# EAGLE design CS-N-NPN (EAGLE 6.5.0)
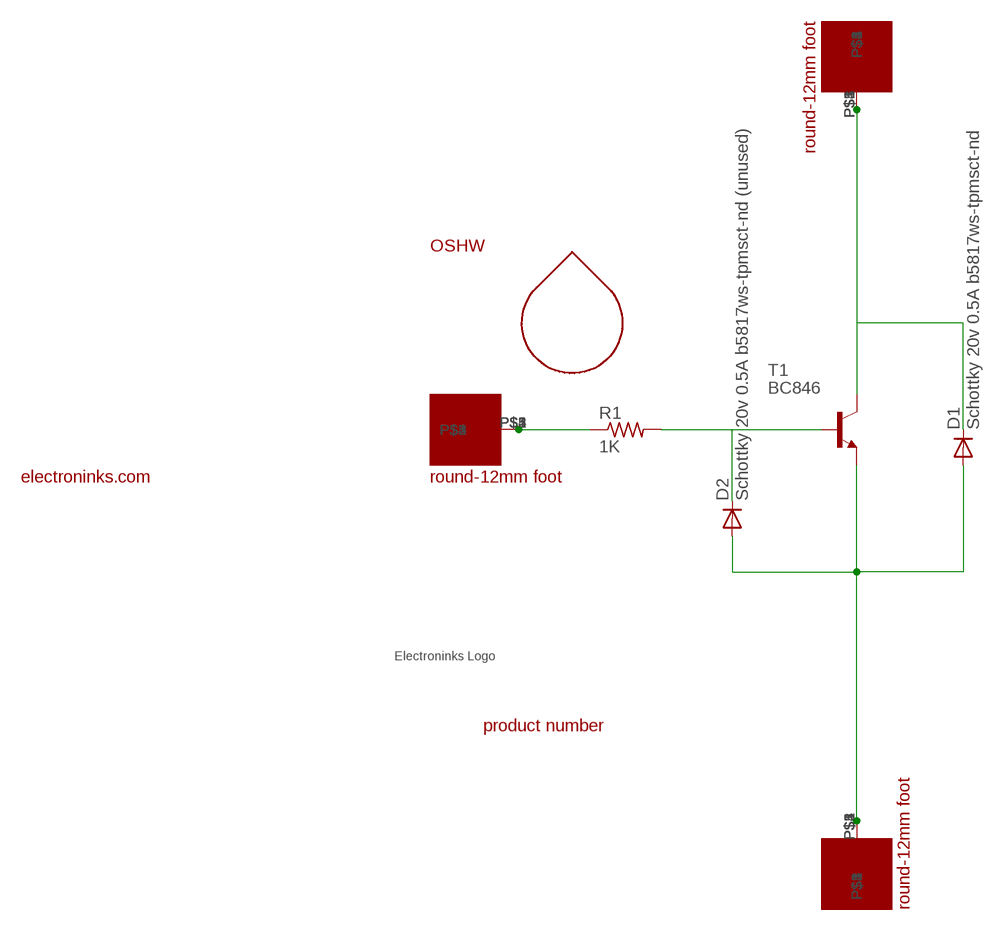
[diagram p0: schematic, sheet 1]

## Parts
D1  Schottky 20v 0.5A b5817ws-tpmsct-nd  DIODESOD  [SOD-323]
D2  Schottky 20v 0.5A b5817ws-tpmsct-nd (unused)  DIODESOD  [SOD-323]
R1  1K  R-US_R0603  [R0603]
T1  BC846  [SOT23]
U$1  ROUND-12MM-FOOT-1.8MM  [ROUND-12MM-FOOT]
U$2  ROUND-12MM-FOOT-1.8MM  [ROUND-12MM-FOOT]
U$3  ROUND-12MM-FOOT-1.8MM  [ROUND-12MM-FOOT]
U$4  ELECTRONINKS_LOGO_15MM  [ELECTRONINKS_LOGO_15MM]
U$5  DROPLET_LOGO_4MM  [DROPLET_LOGO_4MM]
U$6  OSHW_4MM  [OHSW_4MM]
U$7  ELECTRONINKS_COM_15MM  [ELECTRONINKS_COM_15MM]
U$8  CS_N_NPN  [CS_N_NPN]

## Nets
N$1: D1.1(C) T1.3(C) U$1.P$1 U$1.P$2 U$1.P$3 U$1.P$4 U$1.P$5
N$2: D1.2(A) D2.2(A) T1.2(E) U$3.P$1 U$3.P$2 U$3.P$3 U$3.P$4 U$3.P$5
N$3: D2.1(C) R1.2 T1.1(B)
N$4: R1.1 U$2.P$1 U$2.P$2 U$2.P$3 U$2.P$4 U$2.P$5

## Library data of the parts
D1 D2 = SparkFun:DIODE: Diode These are standard reverse protection diodes and small signal diodes. SMA package can handle up to about 1A. SOD-323 can handle about 200mA. What the SOD-323 package when ordering, there are some mfgs out there that are 5-pin packages.
R1 = rcl:R-US_: RESISTOR, American symbol
T1 = transistor:BC846: NPN TRANSISTOR
U$1-U$3 = electroninks:ROUND-12MM-FOOT-1.8MM
U$4 = electroninks:ELECTRONINKS_LOGO_15MM
U$5 = electroninks:DROPLET_LOGO_4MM
U$6 = electroninks:OSHW_4MM
U$7 = electroninks:ELECTRONINKS_COM_15MM
U$8 = electroninks:CS_N_NPN

## Net classes
0 default: width 0.203 mm

## Board
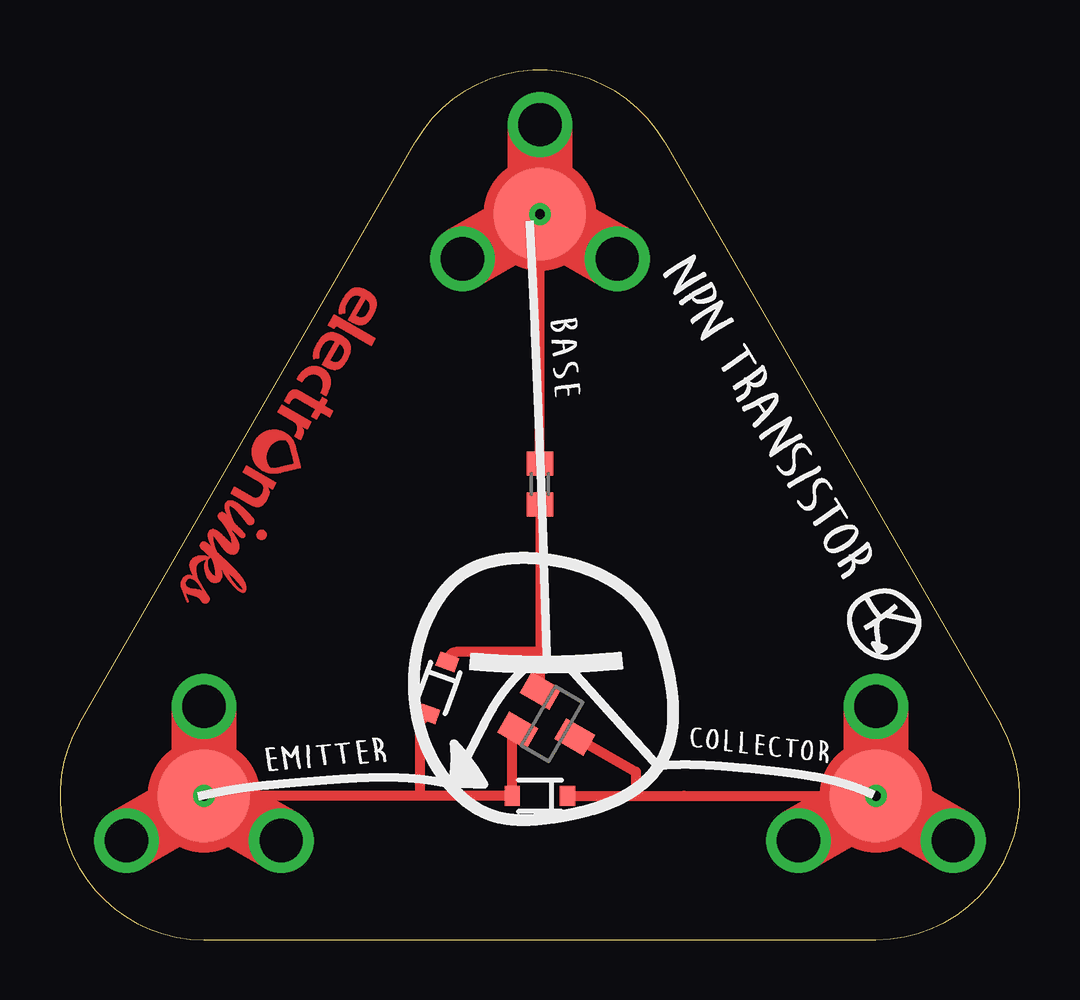
[diagram p1: board, top side]
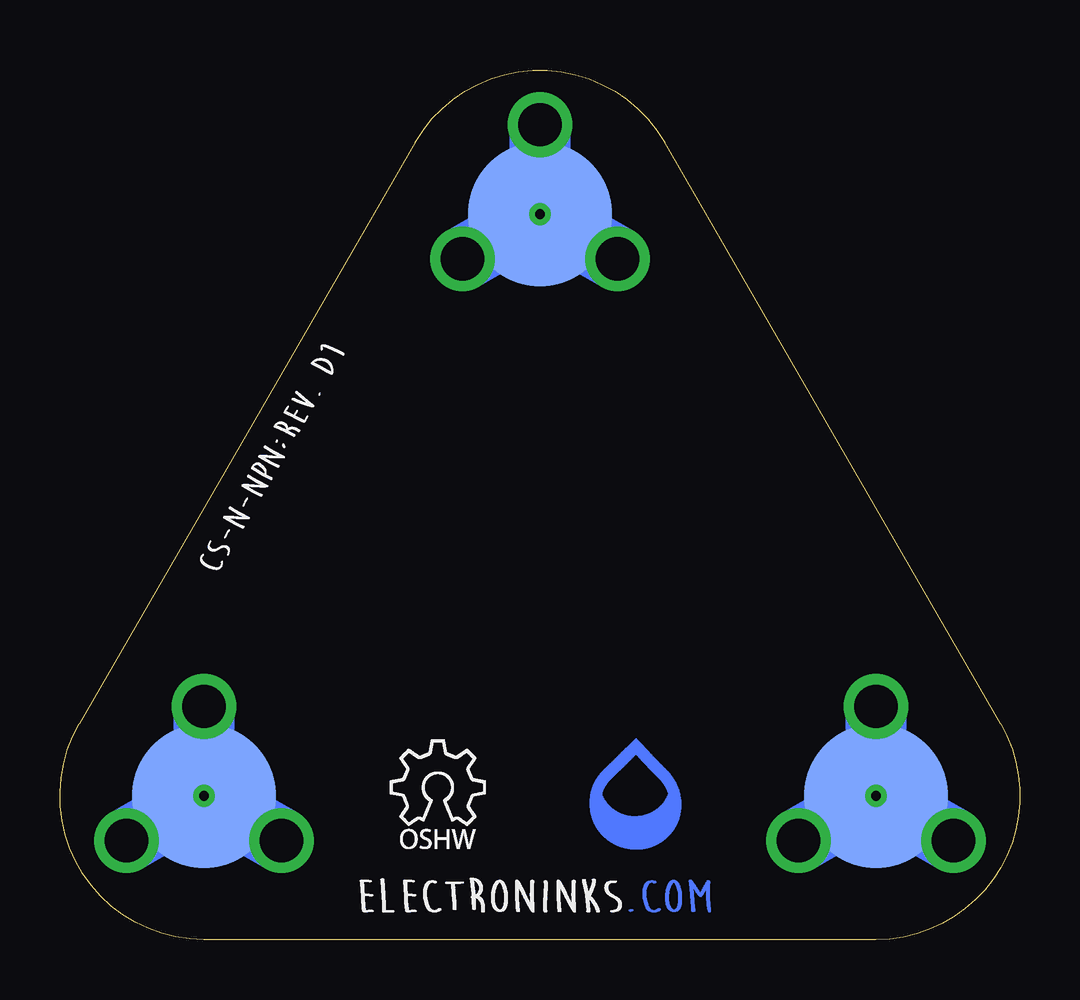
[diagram p2: board, bottom side, seen from below]

Size 39.99 x 36.24 mm. Coordinates in mm from the lower left corner, seen from the top.
Outline: 25.19,33.25 39.19,9 arc-120 33.99,0 5.99,0 arc-120 0.8,9 14.8,33.25 arc-120 25.19,33.25
Copper layers (1*16): Top 0.035mm / dielectric 1.5mm / Bottom 0.035mm
Design rules "default": minimum track width 10mil, minimum drill 24mil, track to track 8mil, track to pad 8mil, pad to pad 8mil, via to via 8mil, smd to smd 8mil, copper to edge 40mil, drill to drill 8mil, minimum pad ring 10mil, minimum via ring 8mil, stop-mask expansion 4mil, vias tented up to drill 0mil, thermal gap 10mil

### Footprints (pad centres in the part's own frame; a part is rotated, then mirrored left to right if it is on the bottom)
SOD-323 = smd 0.63 x 0.83: 1 -1.15,0; 2 1.15,0
R0603 = smd 1 x 1.1: 1 -0.85,0; 2 0.85,0
SOT23 = smd 1 x 1.4: 1 -0.95,-1.1; 2 0.95,-1.1; 3 0,1.1
ROUND-12MM-FOOT = drill 1.8: P$1 -3.726,0; P$2 1.863,3.227; P$3 1.863,-3.227 | smd 3.85 x 3.85: P$4 0,0 | smd 6 x 6 bottom: P$5 0,0 | drill 0.4: P$6 0,0

### Placement (x,y rotation side)
D1  19.99,6 180 top
D2  15.74,10.5 250 top
R1  19.99,19 270 top
T1  20.49,9 240 top
U$1  33.99,6 270 top
U$2  19.99,30.25 270 top
U$3  5.99,6 270 top
U$4  11.99,27.52 240 top
U$5  15.99,5.25 0 bottom
U$6  26.24,3.5 0 bottom
U$7  27.74,0.75 0 bottom
U$8  33.24,15 60 bottom

### Tracks (layer width: path | path; a pad name or v marks a point on that pad's centre or on a via)
N$1
  Top 0.406: D1.1 23.99,6 | U$1.P$5 25.99,6 23.99,6 | T1.3 23.99,7 23.99,6
N$2
  Top 0.406: 14.99,6 D1.2 18.84,8.51 T1.2 | 14.99,6 U$3.P$5 | D2.2 14.99,9.06 14.99,6
  Top 1.016: 2.99,5 U$3.P$5
N$3
  Top 0.406: T1.1 20.02,11.55 20.02,11.98 | 20.02,11.98 arc90 19.99,12 16.56,12 arc90 D2.1 | R1.2 20.02,18.15 20.02,11.98
N$4
  Top 0.406: R1.1 U$2.P$5
  Top 1.016: 19.99,34 U$2.P$5